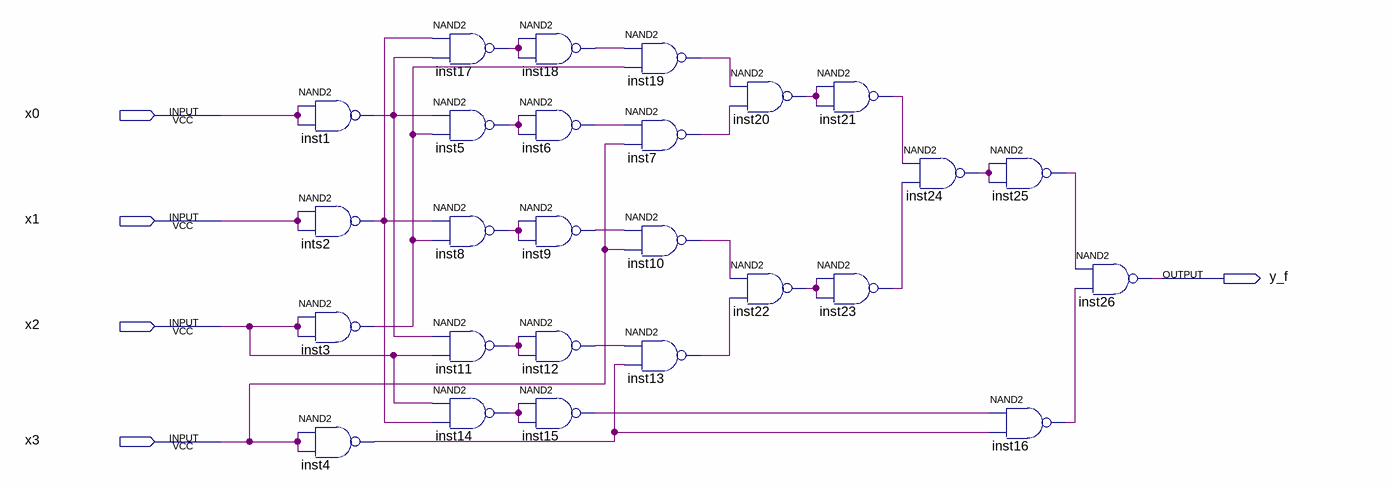
[diagram p0: schematic sheet]
// Quartus schematic y_f.bdf as structural Verilog: 26 symbols, 5 pins
module y_f (
  input  x0,
  input  x1,
  input  x2,
  input  x3,
  output y_f
);

  wire inst1_out, inst3_out, inst4_out, inst5_out, inst6_out, inst7_out, inst8_out, inst9_out, inst10_out,
       inst11_out, inst12_out, inst13_out, inst14_out, inst15_out, inst16_out, inst17_out, inst18_out,
       inst19_out, inst20_out, inst21_out, inst22_out, inst23_out, inst24_out, inst25_out, ints2_out;

  nand inst1 (inst1_out, x0, x0);
  nand ints2 (ints2_out, x1, x1);
  nand inst3 (inst3_out, x2, x2);
  nand inst4 (inst4_out, x3, x3);
  nand inst17 (inst17_out, ints2_out, inst1_out);
  nand inst5 (inst5_out, inst1_out, inst3_out);
  nand inst8 (inst8_out, ints2_out, inst3_out);
  nand inst11 (inst11_out, inst1_out, x2);
  nand inst14 (inst14_out, x2, ints2_out);
  nand inst18 (inst18_out, inst17_out, inst17_out);
  nand inst6 (inst6_out, inst5_out, inst5_out);
  nand inst9 (inst9_out, inst8_out, inst8_out);
  nand inst12 (inst12_out, inst11_out, inst11_out);
  nand inst15 (inst15_out, inst14_out, inst14_out);
  nand inst19 (inst19_out, inst18_out, inst3_out);
  nand inst7 (inst7_out, inst6_out, x3);
  nand inst10 (inst10_out, inst9_out, x3);
  nand inst13 (inst13_out, inst12_out, inst4_out);
  nand inst20 (inst20_out, inst19_out, inst7_out);
  nand inst22 (inst22_out, inst10_out, inst13_out);
  nand inst21 (inst21_out, inst20_out, inst20_out);
  nand inst23 (inst23_out, inst22_out, inst22_out);
  nand inst24 (inst24_out, inst21_out, inst23_out);
  nand inst25 (inst25_out, inst24_out, inst24_out);
  nand inst16 (inst16_out, inst15_out, inst4_out);
  nand inst26 (y_f, inst25_out, inst16_out);
endmodule
